# Altium schematic sheet Flash.SchDoc
size A4; SheetNumber: 5; SheetTotal: 11
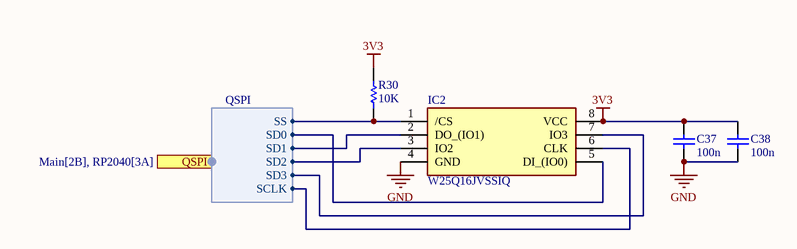
[diagram p0: Flash.SchDoc]

## Parts
C37  100n  [CAPC0603(1608)55_N]
C38  100n  [CAPC0603(1608)55_N]
IC2  W25Q16JVSSIQ  [SOIC127P790X216-8N]
R30  10K  [RESC0603(1608)_N]

## Ports
QSPI (harness QSPI, see Main[2B], RP2040[3A])

## Harnesses
QSPI: SS, SD0, SD1, SD2, SD3, SCLK

## Nets
3V3: C37.2 C38.2 IC2.8(VCC) R30.2
GND: C37.1 C38.1 IC2.4(GND)
NetIC2_1: IC2.1(/CS) R30.1 ; port QSPI.SS
NetIC2_2: IC2.2(DO_(IO1)) ; port QSPI.SD1
NetIC2_3: IC2.3(IO2) ; port QSPI.SD2
NetIC2_5: IC2.5(DI_(IO0)) ; port QSPI.SD0
NetIC2_6: IC2.6(CLK) ; port QSPI.SCLK
NetIC2_7: IC2.7(IO3) ; port QSPI.SD3

## Library data of the parts
C37 C38 = Cap 100n: Keramikvielschichtkondensator, SMD, Baureihe MC, ± 20%; Manufacturer: Multicomp; OC_FARNELL: 1759038; Value: 100n; PackageReference: 0603
IC2 = W25Q16JVSSIQ: Integrated Circuit; Manufacturer_Name: Winbond; Datasheet Link: https://www.winbond.com/hq/search-resource-file.jsp?partNo=W25Q16JVSSIQ&type=datasheet; Height: 2.16mm; Manufacturer_Part_Number: W25Q16JVSSIQ; Mouser Part Number: 454-W25Q16JVSSIQ; Mouser Price/Stock: https://www.mouser.co.uk/ProductDetail/Winbond/W25Q16JVSSIQ?qs=qSfuJ%252Bfl%2Fd46L%2F1QrQC%2Fog%3D%3D; Arrow Part Number: W25Q16JVSSIQ; Arrow Price/Stock: https://www.arrow.com/en/products/w25q16jvssiq/winbond-electronics?region=nac
R30 = Res 100K: Chipwiderstand, SMD, Baureihe MC, 1%; Manufacturer: Multicomp; Value: 100K; PackageReference: 0603; OC_FARNELL: 9330402